# EAGLE design RF Splitter (EAGLE 9.6.2)
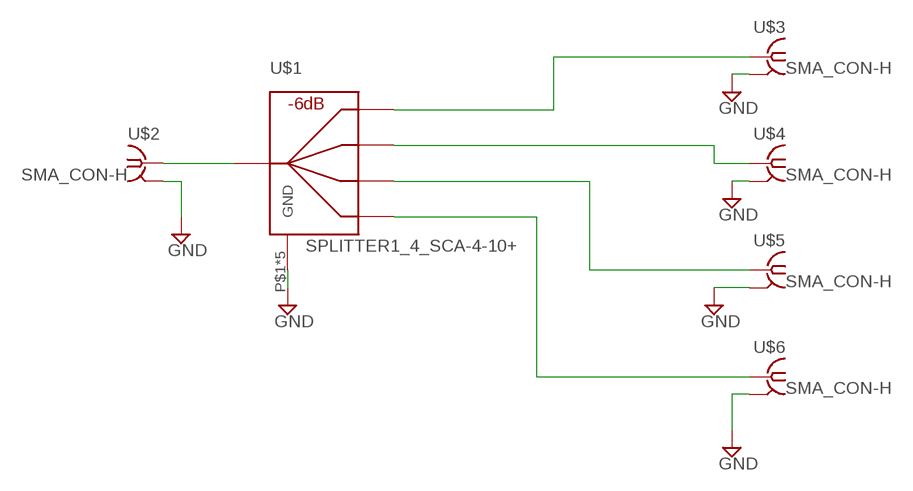
[diagram p0: schematic, sheet 1]

## Parts
U$1  SPLITTER1_4_SCA-4-10+  [SCA-4-10+]
U$2  SMA_CON-H  [BU-SMA-H]
U$3  SMA_CON-H  [BU-SMA-H]
U$4  SMA_CON-H  [BU-SMA-H]
U$5  SMA_CON-H  [BU-SMA-H]
U$6  SMA_CON-H  [BU-SMA-H]

## Nets
GND: U$1.P$1(GND) U$1.P$2(GND) U$1.P$4(GND) U$1.P$5(GND) U$1.P$8(GND) U$2.2(GND) U$2.3(GND) U$2.4(GND) U$2.5(GND) U$3.2(GND) U$3.3(GND) U$3.4(GND) U$3.5(GND) U$4.2(GND) U$4.3(GND) U$4.4(GND) U$4.5(GND) U$5.2(GND) U$5.3(GND) U$5.4(GND) U$5.5(GND) U$6.2(GND) U$6.3(GND) U$6.4(GND) U$6.5(GND)
N$1: U$1.P$3 U$2.1
N$2: U$1.P$6 U$3.1
N$3: U$1.P$7 U$4.1
N$4: U$1.P$9 U$5.1
N$5: U$1.P$10 U$6.1

## Library data of the parts
U$1 = Orzada:SPLITTER1_4: 1:4 Splitter Minicircuits
U$2-U$6 = Orzada:SMA_CON

## Board
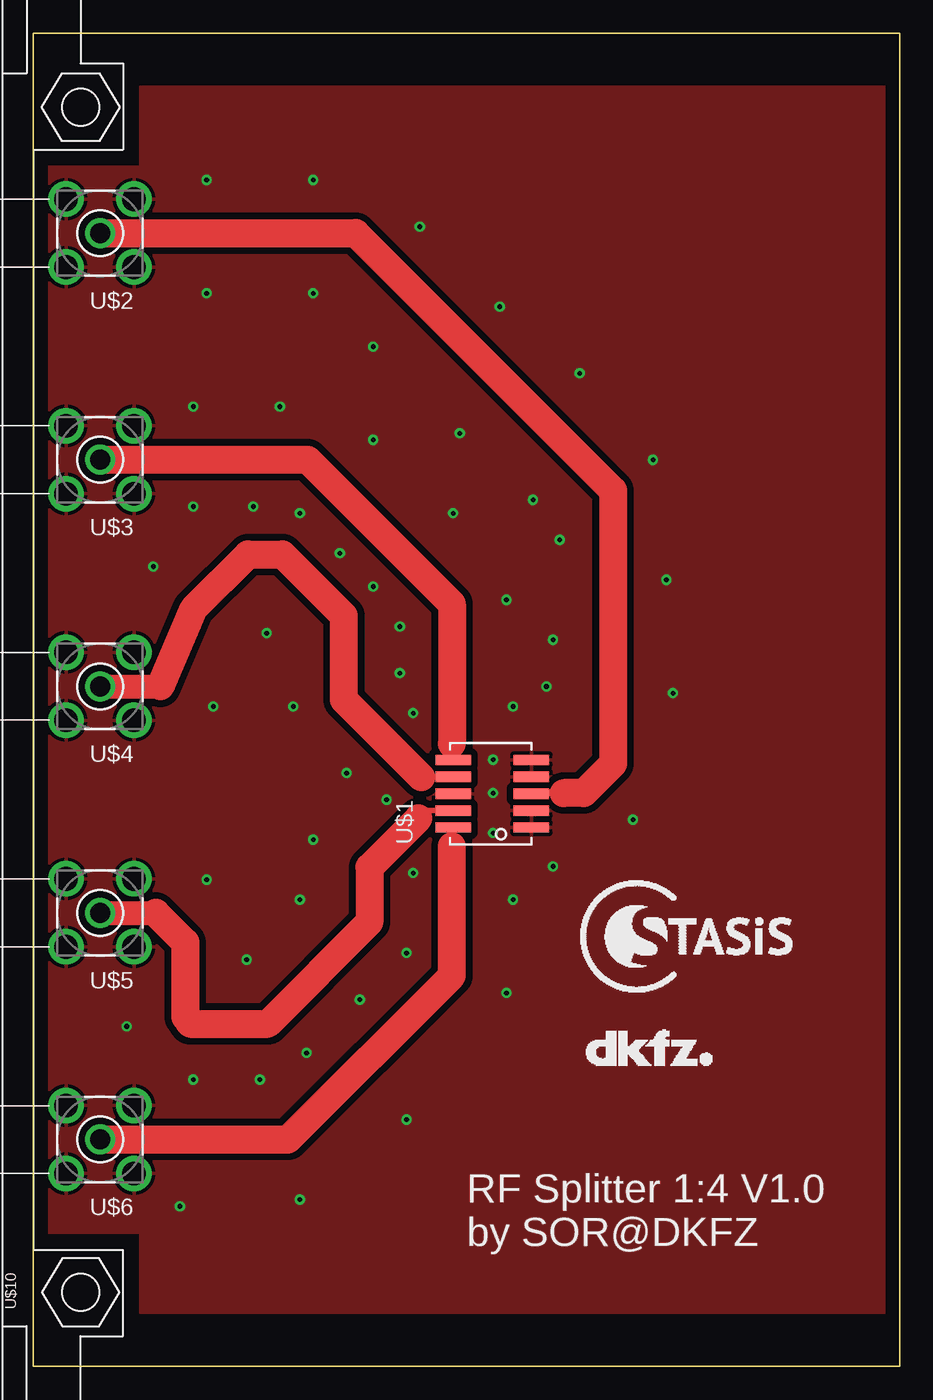
[diagram p1: board, top side]
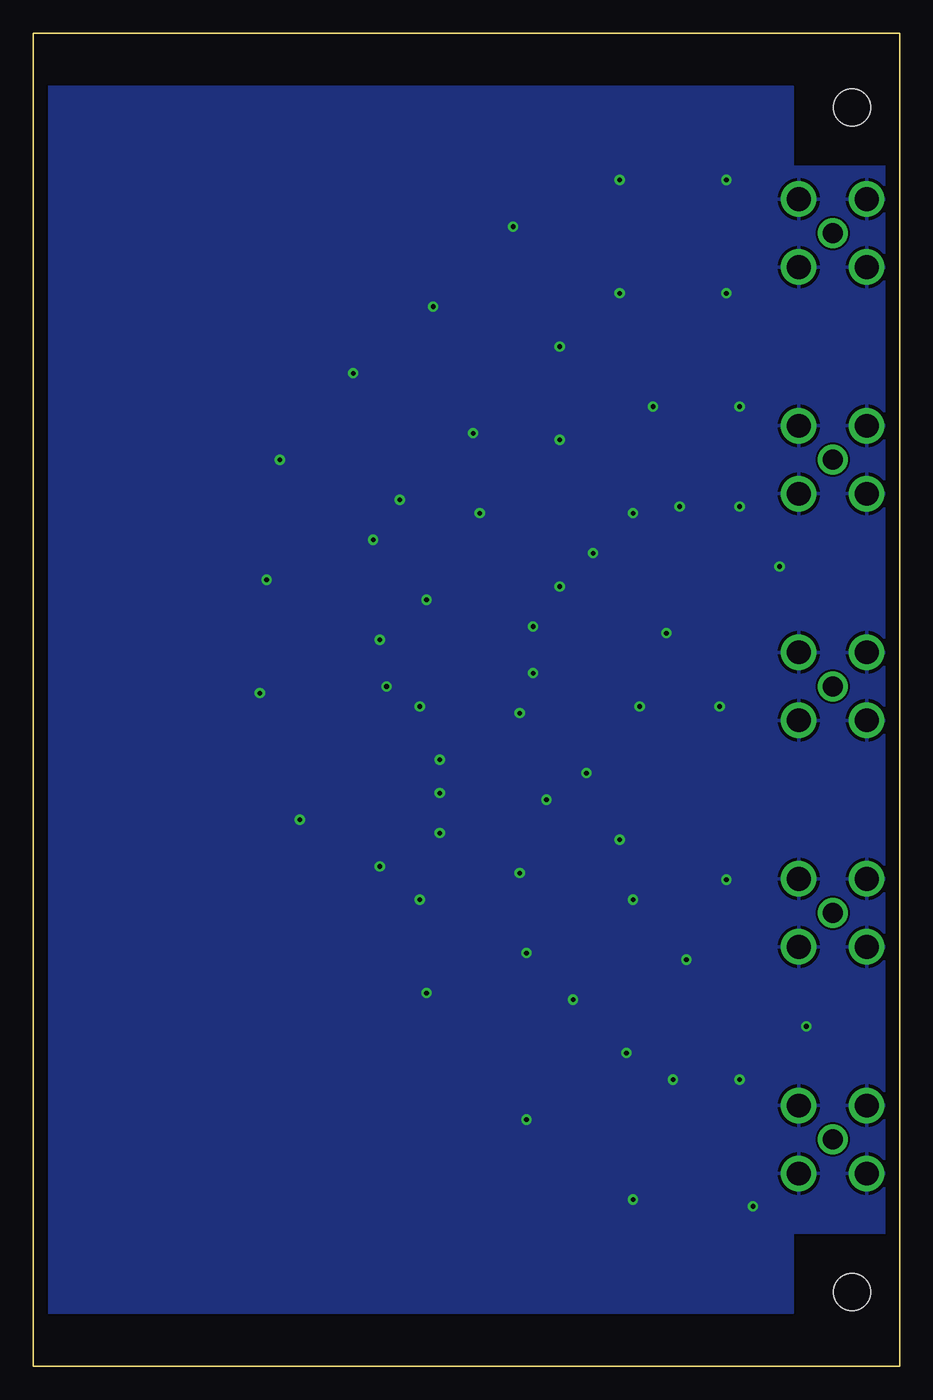
[diagram p2: board, bottom side, seen from below]

Size 65 x 100 mm. Coordinates in mm from the lower left corner, seen from the top.
Outline: 0,0 0,100 65,100 65,0 0,0
Copper layers (1*16): Top 0.035mm / dielectric 1.5mm / Bottom 0.035mm
Design rules "default": minimum track width 6mil, minimum drill 0.35mm, track to track 6mil, track to pad 6mil, pad to pad 6mil, via to via 6mil, smd to smd 6mil, copper to edge 40mil, drill to drill 6mil, minimum pad ring 10mil, minimum via ring 8mil, stop-mask expansion 4mil, vias tented up to drill 0mil, thermal gap 10mil

### Footprints (pad centres in the part's own frame; a part is rotated, then mirrored left to right if it is on the bottom)
SCA-4-10+ = smd 0.762 x 2.667: P$1 0,-0.254; P$2 1.27,-0.254; P$3 2.54,-0.254; P$4 3.81,-0.254; P$5 5.08,-0.254; P$6 5.08,5.613; P$7 3.81,5.613; P$8 2.54,5.613; P$9 1.27,5.613; P$10 0,5.613
BU-SMA-H = drill 1.5: 1 0,0 | drill 1.778: 2 -2.55,2.55; 3 2.55,2.55; 4 2.55,-2.55; 5 -2.55,-2.55
FPH = hole 2.794: 3.556,44.45; 3.556,-44.45

### Placement (x,y rotation side)
U$1  37.12,40.41 90 top
U$2  5.01,85.01 180 top
U$3  5.01,68.01 180 top
U$4  5.01,51.01 180 top
U$5  5.01,34.01 180 top
U$6  5.01,17.01 180 top
U$8  [LOGO_STASIS]  50,32 0 top
U$9  [LOGO_DKFZ]  41.5,22.5 0 top
U$10  [FPH]  0,50 0 top

### Tracks (layer width: path | path; a pad name or v marks a point on that pad's centre or on a via)
GND  (via drill 0.35)
  other vias: 12,64.5 16.5,64.5 20,64 23,61 25.5,58.5 27.5,55.5 27.5,52 28.5,49 17.5,55 13.5,49.5 9,60 19.5,49.5 23.5,44.5 26.5,42.5 21,39.5 20,35 16,30.5 13,36.5 28.5,37 28,31 24.5,27.5 20.5,23.5 17,21.5 12,21.5 7,25.5 11,12 20,12.5 28,18.5 35.5,28 36,35 34.5,43 34.5,45.5 34.5,40 39,37.5 45,41 48,50.5 47.5,59 46.5,68 41,74.5 35,79.5 29,85.5 21,89 13,89 13,80.5 21,80.5 25.5,76.5 32,70 37.5,65 39.5,62 39,54.5 38.5,51 36,49.5 35.5,57.5 31.5,64 25.5,69.5 18.5,72 12,72
  pour Top (isolate 0.5): 8,96 8,90 1,90 1,10 8,10 8,4 64,4 64,96
  pour Bottom: 8,96 8,90 1,90 1,10 8,10 8,4 64,4 64,96
N$1
  Top 0.508: U$1.P$3 37.42,43 39.8,43
  Top 2.1: U$2.1 24.19,85.01 43.5,65.7 43.5,45.2 41.3,43 39.8,43
N$2
  Top 0.406: 31.4,46.7 31.4,45.6 U$1.P$6
  Top 2.1: U$3.1 20.59,68.01 31.4,57.2 31.4,46.7
N$3
  Top 0.406: 29.1,44.2 31.49,44.2 U$1.P$7
  Top 1.8: U$4.1 9.52,51.01
  Top 2.1: 9.52,51.01 12,56.8 16.1,60.9 18.7,60.9 23.3,56.3 23.3,50 29.1,44.2
N$4
  Top 0.406: 28.9,41.1 28.9,41.68 U$1.P$9
  Top 1.8: U$5.1 9.19,34.01
  Top 2.1: 28.9,41.1 25.23,37.43 25.23,33.33 17.6,25.7 11.77,25.7 11.5,26.1 11.4,26.2 11.4,31.8 9.19,34.01
N$5
  Top 0.406: 31.4,39 31.4,40.3 U$1.P$10
  Top 2.1: U$6.1 19.11,17.01 31.4,29.3 31.4,39

### Text on the board
tPlace: RF Splitter 1:4 V1.0 / by SOR@DKFZ